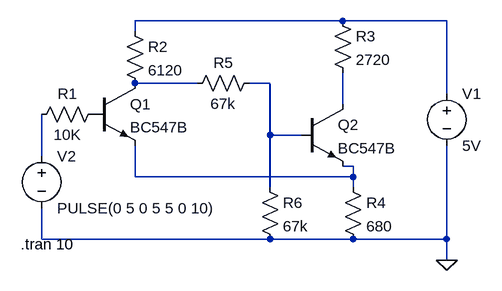
[diagram p0: schematic MajchrowskiMateusz.asc]
MajchrowskiMateusz.asc, the LTspice schematic file:
Version 4
SHEET 1 880 680
WIRE 288 48 -32 48
WIRE 448 48 288 48
WIRE -32 64 -32 48
WIRE 64 144 -32 144
WIRE 176 144 144 144
WIRE 448 160 448 48
WIRE 288 176 288 128
WIRE 176 224 176 144
WIRE 224 224 176 224
WIRE -176 256 -176 192
WIRE 304 272 288 272
WIRE -32 288 -32 240
WIRE 304 288 304 272
WIRE 304 288 -32 288
WIRE 176 304 176 224
WIRE 304 304 304 288
WIRE -176 384 -176 336
WIRE 176 384 -176 384
WIRE 304 384 176 384
WIRE 448 384 448 240
WIRE 448 384 304 384
WIRE 448 416 448 384
FLAG 448 416 0
SYMBOL voltage 448 144 R0
WINDOW 123 0 0 Left 2
WINDOW 39 0 0 Left 2
SYMATTR InstName V1
SYMATTR Value 5V
SYMBOL voltage -176 240 R0
WINDOW 123 0 0 Left 2
WINDOW 39 0 0 Left 2
SYMATTR InstName V2
SYMATTR Value PULSE(0 5 0 5 5 0 10)
SYMBOL res -80 176 R90
WINDOW 0 0 56 VBottom 2
WINDOW 3 32 56 VTop 2
SYMATTR InstName R1
SYMATTR Value 10K
SYMBOL npn -96 144 R0
SYMATTR InstName Q1
SYMATTR Value BC547B
SYMBOL res 288 288 R0
SYMATTR InstName R4
SYMATTR Value 680
SYMBOL res 160 288 R0
SYMATTR InstName R6
SYMATTR Value 67k
SYMBOL npn 224 176 R0
SYMATTR InstName Q2
SYMATTR Value BC547B
SYMBOL res 272 32 R0
SYMATTR InstName R3
SYMATTR Value 2720
SYMBOL res -48 48 R0
SYMATTR InstName R2
SYMATTR Value 6120
SYMBOL res 160 128 R90
WINDOW 0 0 56 VBottom 2
WINDOW 3 32 56 VTop 2
SYMATTR InstName R5
SYMATTR Value 67k
TEXT -208 392 Left 2 !.tran 10

The netlist it stands for:
* MajchrowskiMateusz.asc
V1 N001 0 5V
V2 N005 0 PULSE(0 5 0 5 5 0 10)
R1 P001 N005 10K
Q1 N002 P001 N006 0 BC547B
R4 N006 0 680
R6 N003 0 67k
Q2 N004 N003 N006 0 BC547B
R3 N001 N004 2720
R2 N001 N002 6120
R5 N003 N002 67k
.model NPN NPN
.model PNP PNP
.lib standard.bjt
.tran 10
.backanno
.end